# EAGLE design photoduino.shield.v.3.0 (EAGLE 6.1)
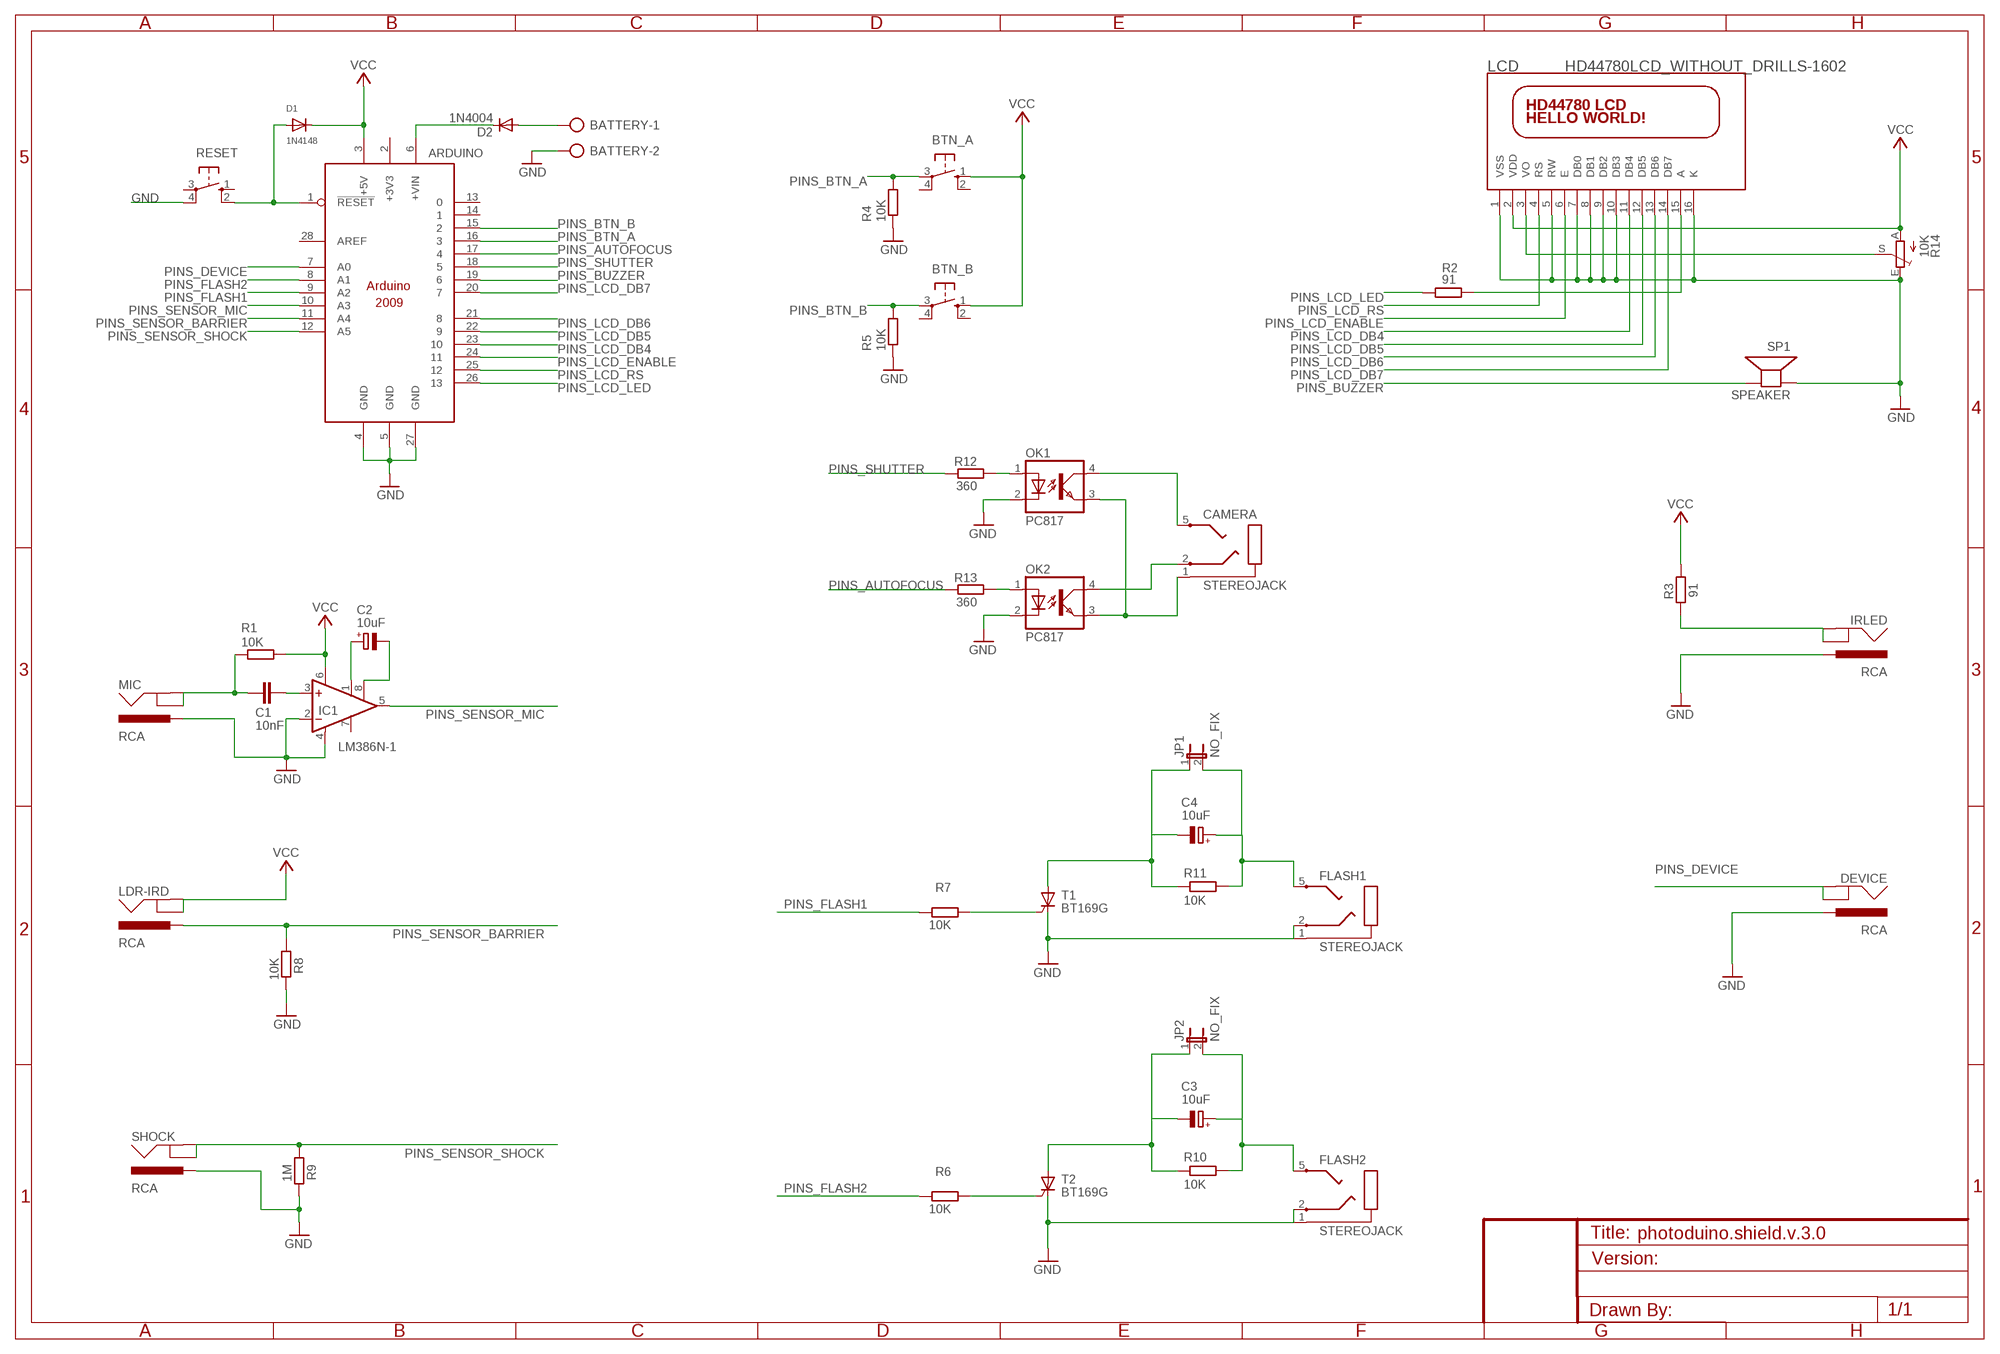
[diagram p0: schematic, sheet 1]

## Parts
ARDUINO  ARDUINO2009_12  [ARDUINO2009_2]
BATTERY  AK500/2  [AK500/2]
BTN_A  10-XX  [B3F-10XX]
BTN_B  10-XX  [B3F-10XX]
C1  10nF  C-EU050-025X075  [C050-025X075]
C2  10uF  CPOL-EUE2.5-7  [E2,5-7]
C3  10uF  CPOL-EUE2.5-7  [E2,5-7]
C4  10uF  CPOL-EUE2.5-7  [E2,5-7]
CAMERA  STEREOJACK  [STX3100-3N]
D1  1N4148  DIODEDO-1N4148  [DO-1N4148]
D2  1N4004  [DO41-10]
DEVICE  RCA  RCA_JACK_4UCON  [RCA_4UCON]
FLASH1  STEREOJACK  [STX3100-3N]
FLASH2  STEREOJACK  [STX3100-3N]
IC1  LM386N-1  [DIL08]
IRLED  RCA  RCA_JACK_4UCON  [RCA_4UCON]
JP1  NO_FIX  JP1E  [JP1]
JP2  NO_FIX  JP1E  [JP1]
LCD  HD44780LCD_WITHOUT_DRILLS-1602  [LCD1602]
LDR-IRD  RCA  RCA_JACK_4UCON  [RCA_4UCON]
MIC  RCA  RCA_JACK_4UCON  [RCA_4UCON]
OK1  PC817  [DIL04]
OK2  PC817  [DIL04]
R1  10K  R-EU_0207/7  [0207/7]
R2  91  R-EU_0207/7  [0207/7]
R3  91  R-EU_0207/7  [0207/7]
R4  10K  R-EU_0207/7  [0207/7]
R5  10K  R-EU_0207/7  [0207/7]
R6  10K  R-EU_0207/7  [0207/7]
R7  10K  R-EU_0207/7  [0207/7]
R8  10K  R-EU_0207/7  [0207/7]
R9  1M  R-EU_0207/7  [0207/7]
R10  10K  R-EU_0207/7  [0207/7]
R11  10K  R-EU_0207/7  [0207/7]
R12  360  R-EU_0207/7  [0207/7]
R13  360  R-EU_0207/7  [0207/7]
R14  10K  TRIM_EU-B25U  [B25U]
RESET  10-XX  [B3F-10XX]
SHOCK  RCA  RCA_JACK_4UCON  [RCA_4UCON]
SP1  SPEAKER  SPEAKER/PS12  [PS12]
T1  BT169G  BT169  [TO92-2]
T2  BT169G  BT169  [TO92-2]

## Nets
GND: ARDUINO.4(GND) ARDUINO.5(GND) ARDUINO.27(GND) BATTERY.2 DEVICE.BARREL FLASH1.1 FLASH1.2 FLASH2.1 FLASH2.2 IC1.2(-IN) IC1.4(GND) IRLED.BARREL LCD.1(VSS) LCD.5(RW) LCD.7(DB0) LCD.8(DB1) LCD.9(DB2) LCD.10(DB3) LCD.16(K) MIC.BARREL OK1.2(C) OK2.2(C) R4.1 R5.1 R8.2 R9.2 R14.E RESET.4(P1) SHOCK.BARREL SP1.P$1(+) T1.C T2.C
LCD_CONTRAST: LCD.3(VO) R14.S
N$1: IRLED.BREAK IRLED.SPRING R3.2
N$2: CAMERA.1 OK1.3(EMIT) OK2.3(EMIT)
N$3: C4.+ FLASH1.5 JP1.2 R11.2
N$4: R6.1 T2.G
N$5: ARDUINO.1(!RESET) D1.A RESET.2(S1)
N$6: C4.- JP1.1 R11.1 T1.A
N$8: C3.+ FLASH2.5 JP2.2 R10.2
N$9: C3.- JP2.1 R10.1 T2.A
N$11: ARDUINO.6(+VIN) D2.C
N$12: C1.1 IC1.3(+IN)
N$13: BATTERY.1 D2.A
N$16: C1.2 MIC.BREAK MIC.SPRING R1.1
N$18: R7.1 T1.G
N$21: CAMERA.5 OK1.4(COL)
N$23: OK1.1(A) R12.1
N$25: OK2.1(A) R13.1
N$27: C2.+ IC1.1(GAIN)
N$31: C2.- IC1.8(GAIN)
N$32: LCD.15(A) R2.1
PINS_AUTOFOCUS: ARDUINO.17 R13.2
PINS_BTN_A: ARDUINO.16 BTN_A.3(P) R4.2
PINS_BTN_B: ARDUINO.15 BTN_B.3(P) R5.2
PINS_BUZZER: ARDUINO.19 SP1.P$2(-)
PINS_DEVICE: ARDUINO.7(A0) DEVICE.BREAK DEVICE.SPRING
PINS_FLASH1: ARDUINO.9(A2) R7.2
PINS_FLASH2: ARDUINO.8(A1) R6.2
PINS_LCD_DB4: ARDUINO.23 LCD.11(DB4)
PINS_LCD_DB5: ARDUINO.22 LCD.12(DB5)
PINS_LCD_DB6: ARDUINO.21 LCD.13(DB6)
PINS_LCD_DB7: ARDUINO.20 LCD.14(DB7)
PINS_LCD_ENABLE: ARDUINO.24 LCD.6(E)
PINS_LCD_LED: ARDUINO.26 R2.2
PINS_LCD_RS: ARDUINO.25 LCD.4(RS)
PINS_SENSOR_BARRIER: ARDUINO.11(A4) LDR-IRD.BARREL R8.1
PINS_SENSOR_MIC: ARDUINO.10(A3) IC1.5(OUT)
PINS_SENSOR_SHOCK: ARDUINO.12(A5) R9.1 SHOCK.BREAK SHOCK.SPRING
PINS_SHUTTER: ARDUINO.18 R12.2
SHUTTER: CAMERA.2 OK2.4(COL)
VCC: ARDUINO.3(+5V) BTN_A.1(S) BTN_B.1(S) D1.C IC1.6(VS) LCD.2(VDD) LDR-IRD.BREAK LDR-IRD.SPRING R1.2 R3.1 R14.A
Unconnected: ARDUINO.13 ARDUINO.14 ARDUINO.28(AREF) BTN_A.2(S1) BTN_A.4(P1) BTN_B.2(S1) BTN_B.4(P1) IC1.7(BYPASS) RESET.1(S) RESET.3(P)

## Notes on the sheet
- DISPLAY LCD & BUZZER
- SENSORS
- SOUND SENSOR | BARRIER SENSOR | SHOCK SENSOR
- CONTROLLED DEVICES
- CAMERA CONTROL | FLASH1 CONTROL | FLASH2 CONTROL | DEVICE I/O PORT

## Power pins joined to a net without a drawn wire
+3V3: ARDUINO.2(+3V3)

## Library data of the parts
ARDUINO = componentes:ARDUINO2009_1: The Arduino Duemilanove ("2009") is a microcontroller board based on the ATmega168 or ATmega328. - 14 digital input/output pins (of which 6 can be used as PWM outputs) - 6 analog inputs, a 16 MHz crystal oscillator - USB connection - power jack - ISP header - reset button It contains everything needed to support the microcontroller; simply connect it to a computer with a USB cable or power it with a AC-to-DC adapter or battery to get started http://arduino.cc/en/Main/ArduinoBoardDuemilanove
BATTERY = con-ptr500:AK500/2: CONNECTOR; OC_FARNELL: unknown; OC_NEWARK: unknown
BTN_A BTN_B RESET = switch-omron:10-XX: OMRON SWITCH; MPN: B3F-1000; OC_FARNELL: 176432; OC_NEWARK: 36M3542
C1 = resistor:C-EU: CAPACITOR, European symbol
C2-C4 = resistor:CPOL-EU: POLARIZED CAPACITOR, European symbol
CAMERA FLASH1 FLASH2 = componentes:STEREOJACK: MIC/HEADPHONE JACK Stereo jack with two switches. Kycon STX3100-N
D1 = adafruit:DIODE: Diode SMADIODE - SMA Surface Mount Package 20V 1A Schottky Diode Digikey: 641-1014-6-ND DO-1N4148 - Through Hole Small Current Diode SOD-123 20V 1 A (.5mV Vf) Schottky Diode - Digikey: MBRX120TPMSCT-ND SOD-323 10V 570mA (.38mV Vf, 3ns) Schottky Diode - Digikey: ZLLS410CT-ND SOD-523 30V 30mA Schottky Diode (RB751S-40TE61) - Digikey: RB751S-40TE61CT-ND SOT23-R/W - SOT23 Package (R = Solder Paste/Reflow Ovens, W = Hand-Soldering) BAT54Film 40V 300mA - Digikey: 497-7162-1-ND
D2 = adafruit:1N4004: DIODE General purpose 1N400x type rectifier (With bigger pads) http://www.ladyada.net/library/pcb/eaglelibrary.html
DEVICE IRLED LDR-IRD MIC SHOCK = componentes:RCA_JACK_4UCON
IC1 = linear:LM386?-*: Low Voltage Audio Power Amplifier Source: http://cache.national.com/ds/LM/LM386.pdf
JP1 JP2 = jumper:JP1E: JUMPER
LCD = componentes:HD44780LCD_WITHOUT_DRILLS: HD44780 LCD Standard character type LCDs, available in sizes from 8x1 to 40x4!
OK1 OK2 = componentes:PC817: SHARP OPTO COUPLER; MPN: PC817X4J000F; OC_FARNELL: 9707727; OC_NEWARK: 97K7059
R1-R13 = resistor:R-EU_: RESISTOR, European symbol
R14 = componentes:TRIM_EU-: POTENTIOMETER
SP1 = adafruit:SPEAKER: SPEAKER Source: Buerklin Added PS12 (for part # PS1240 piezo) http://www.ladyada.net/library/pcb/eaglelibrary.html
T1 T2 = componentes:BT169: THYRISTOR

## Board
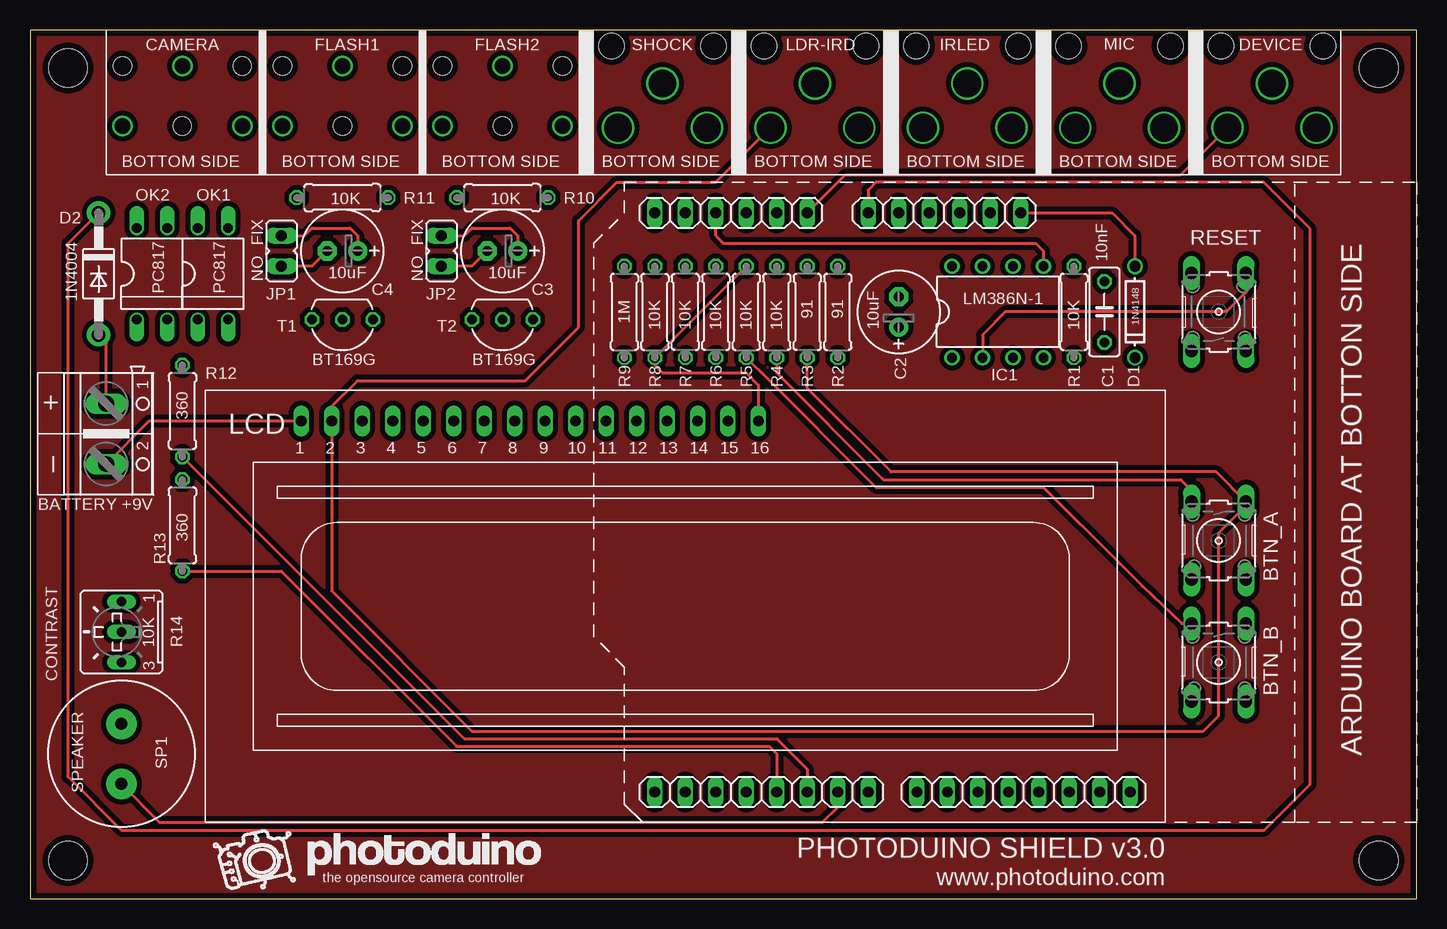
[diagram p1: board, top side]
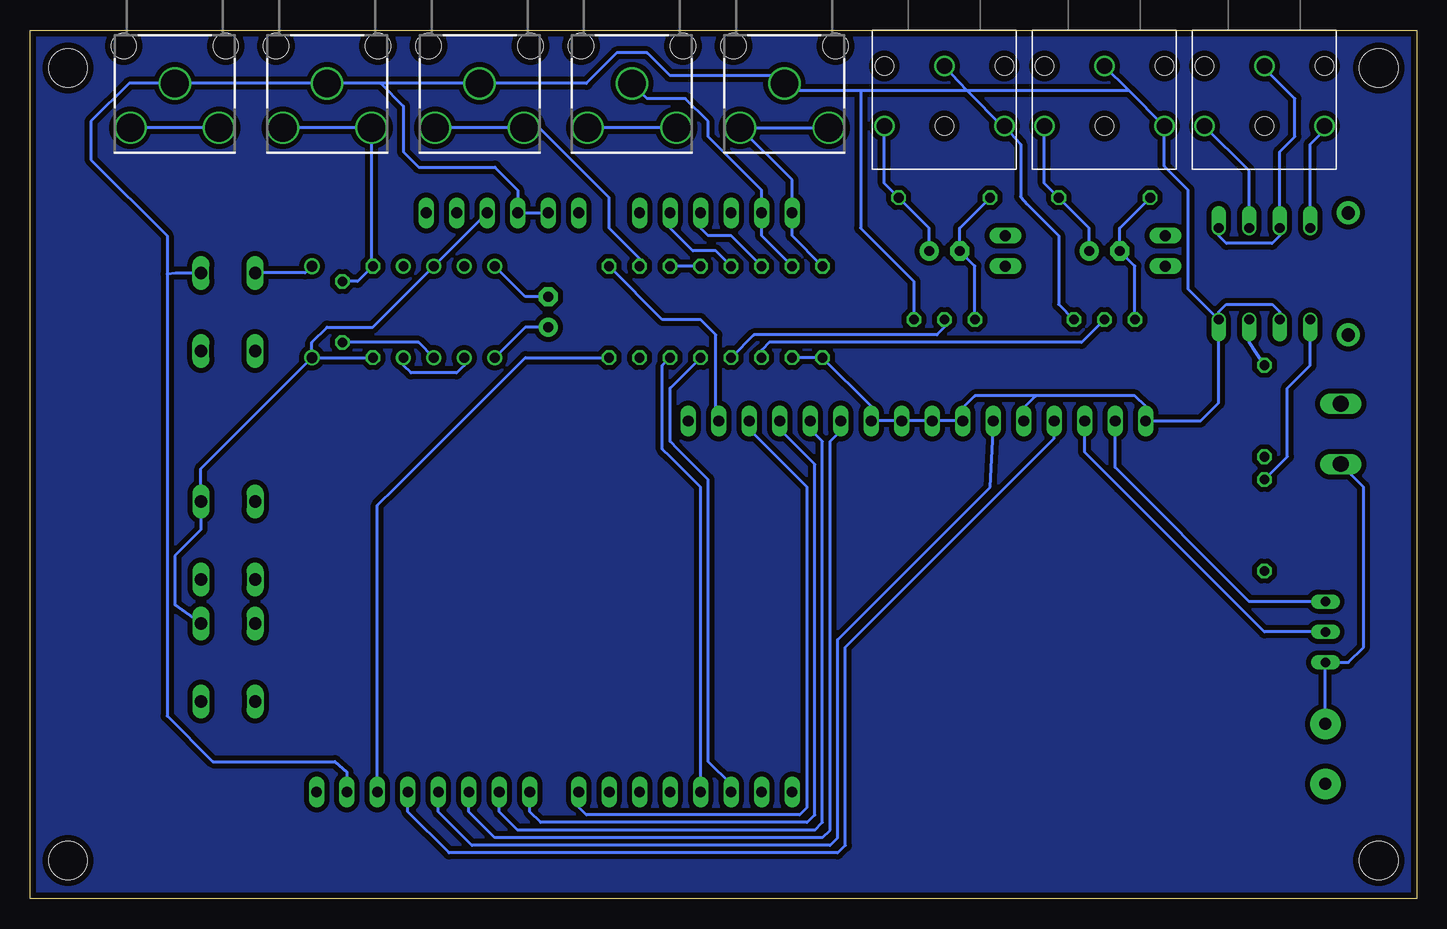
[diagram p2: board, bottom side, seen from below]

Size 115.57 x 72.39 mm. Coordinates in mm from the lower left corner, seen from the top.
Outline: 115.57,72.39 0,72.39 0,0 115.57,0 115.57,72.39
Copper layers (1*16): Top 0.035mm / dielectric 1.5mm / Bottom 0.035mm
Design rules: minimum track width 8mil, minimum drill 0.3mm, track to track 8mil, track to pad 8mil, pad to pad 8mil, via to via 8mil, smd to smd 8mil, copper to edge 20mil, drill to drill 8mil, minimum pad ring 8mil, minimum via ring 4mil, stop-mask expansion 3mil, vias tented up to drill 0mil, thermal gap 8mil
Holes 3.2 mm at 3.17,69.22 112.4,69.22 112.4,3.17 3.17,3.17

### Footprints (pad centres in the part's own frame; a part is rotated, then mirrored left to right if it is on the bottom)
ARDUINO2009_2 = drill 0.9 long: 1 33.02,2.54; 2 35.56,2.54; 3 38.1,2.54; 4 40.64,2.54; 5 43.18,2.54; 6 45.72,2.54; 7 50.8,2.54; 8 53.34,2.54; 9 55.88,2.54; 10 58.42,2.54; 11 60.96,2.54; 12 63.5,2.54; 13 63.5,50.8; 14 60.96,50.8; 15 58.42,50.8; 16 55.88,50.8; 17 53.34,50.8; 18 50.8,50.8; 19 48.26,50.8; 20 45.72,50.8; 21 41.656,50.8; 22 39.116,50.8; 23 36.576,50.8; 24 34.036,50.8; 25 31.496,50.8; 26 28.956,50.8; 27 26.416,50.8; 28 23.876,50.8
AK500/2 = drill 1.321 long: 1 -2.515,0; 2 2.515,0
B3F-10XX = drill 1.016 long: 1 -3.251,2.261; 2 3.251,2.261; 3 -3.251,-2.261; 4 3.251,-2.261
C050-025X075 = drill 0.813 octagon: 1 -2.54,0; 2 2.54,0
E2,5-7 = drill 0.813 pad 1.6: + -1.27,0 | drill 0.813 pad 1.6 octagon: - 1.27,0
STX3100-3N = drill 1.3: 1 3,0; 2 8,5; 5 8,-5 | hole 1.5: 3,5; 3,-5; 8,0
DO-1N4148 = drill 0.9: A -3.81,0; C 3.81,0
DO41-10 = drill 1.118 pad 1.93: A 5.08,0; C -5.08,0
RCA_4UCON = drill 2.3: BARREL 0,0; BREAK 3.7,3.7; SPRING 3.7,-3.7 | hole 2.1: -3.1,4.25; -3.1,-4.25
DIL08 = drill 0.813 pad 1.27: 1 -3.81,-3.81; 2 -1.27,-3.81; 3 1.27,-3.81; 4 3.81,-3.81; 5 3.81,3.81; 6 1.27,3.81; 7 -1.27,3.81; 8 -3.81,3.81
JP1 = drill 0.914 long: 1 0,-1.27; 2 0,1.27
LCD1602 = drill 0.9 long: 1 8,33.46; 2 10.54,33.46; 3 13.08,33.46; 4 15.62,33.46; 5 18.16,33.46; 6 20.7,33.46; 7 23.24,33.46; 8 25.78,33.46; 9 28.32,33.46; 10 30.86,33.46; 11 33.4,33.46; 12 35.94,33.46; 13 38.48,33.46; 14 41.02,33.46; 15 43.56,33.46; 16 46.1,33.46
DIL04 = drill 0.813 offset: 1 -1.27,-3.81; 2 1.27,-3.81; 3 1.27,3.81; 4 -1.27,3.81
0207/7 = drill 0.813 octagon: 1 -3.81,0; 2 3.81,0
B25U = drill 0.8 long: A 2.54,0; E -2.54,0; S 0,0
PS12 = drill 1 pad 2.54: P$1 -2.5,0; P$2 2.5,0
TO92-2 = drill 0.813 octagon: A 2.54,0; C -2.54,0; G 0,0

### Placement (x,y rotation side)
ARDUINO  115.57,59.69 180 top
BATTERY  6.35,38.73 270 top
BTN_A  99.06,29.84 270 top
BTN_B  99.06,19.69 270 top
C1  89.53,48.9 90 top
C2  72.39,48.9 90 top
C3  39.37,53.98 180 top
C4  26.04,53.98 180 top
CAMERA  12.7,72.39 270 bottom
D1  92.08,48.9 270 top
D2  5.71,52.07 270 top
DEVICE  103.51,67.94 270 bottom
FLASH1  26.04,72.39 270 bottom
FLASH2  39.37,72.39 270 bottom
IC1  80.65,48.9 0 top
IRLED  78.11,67.94 270 bottom
JP1  20.95,53.98 0 top
JP2  34.29,53.98 0 top
LCD  14.61,6.35 0 top
LDR-IRD  65.41,67.94 270 bottom
MIC  90.81,67.94 270 bottom
OK1  15.24,52.07 0 top
OK2  10.16,52.07 0 top
R1  87,48.9 270 top
R2  67.31,48.9 270 top
R3  64.77,48.9 90 top
R4  62.23,48.9 270 top
R5  59.69,48.9 270 top
R6  57.15,48.9 90 top
R7  54.61,48.9 90 top
R8  52.07,48.9 270 top
R9  49.53,48.9 270 top
R10  39.37,58.42 0 top
R11  26.04,58.42 0 top
R12  12.7,40.64 270 top
R13  12.7,31.12 270 top
R14  7.62,22.23 90 top
RESET  99.06,48.9 90 top
SHOCK  52.7,67.94 270 bottom
SP1  7.62,12.06 270 top
T1  26.04,48.26 180 top
T2  39.37,48.26 180 top
U$2  [LOGOPHOTODUINO2]  15.24,0.63 0 top

### Tracks (layer width: path | path; a pad name or v marks a point on that pad's centre or on a via)
GND
  Top 0.254: R5.1 R8.2 52.07,44.45 52.7,43.82 59.69,43.82 60.7,42.8 LCD.16 | RESET.4 101.32,50.52 99.7,48.9 81.28,48.9 79.38,46.99 IC1.2 | LCD.1 9.94,39.81 BATTERY.2
  Bottom 0.254: OK2.2 11.43,48.9 12.06,49.53 15.88,49.53 16.51,48.9 OK1.2 | R5.1 R4.1 | IC1.2 79.38,44.45 80.01,43.82 83.82,43.82 84.45,44.45 IC1.4 | R8.2 R9.2 45.47,41.02 LCD.10 LCD.9 LCD.8 LCD.7 37.84,40.9 36.83,41.91 31.75,41.91 | ARDUINO.5 ARDUINO.4 74.93,59.05 76.84,60.96 83.19,60.96 84.45,62.23 84.45,66.04 86.36,67.94 | OK1.2 16.51,41.33 18.03,39.81 LCD.1 22.61,41.02 23.5,41.91 31.75,41.91 | 37.47,67.31 46.36,67.31 | 46.36,67.31 52.07,67.31 SHOCK.BARREL 53.34,68.58 62.23,68.58 64.14,70.48 66.67,70.48 69.22,67.94 IRLED.BARREL 86.36,67.94 | 37.47,67.31 FLASH2.1 | T1.C 29.84,49.53 29.84,55.25 32.47,57.87 33.02,58.5 33.02,62.87 FLASH2.2 34.55,64.39 37.47,67.31 | T2.C 41.91,51.44 46.36,55.88 46.36,67.31 | 86.36,67.94 MIC.BARREL DEVICE.BARREL 107.31,67.94 110.49,64.77 110.49,61.59 104.14,55.25 104.14,52.07 | LCD.5 32.77,40.9 31.75,41.91 | 23.95,67.31 FLASH1.1 | OK1.2 19.05,50.8 19.05,59.05 21.04,61.04 FLASH1.2 23.95,67.31 | SP1.P$1 R14.E 5.71,19.69 4.45,20.95 4.45,34.29 6.35,36.2 BATTERY.2 | 104.14,52.07 104.14,15.24 100.33,11.43 90.17,11.43 89.15,10.54 ARDUINO.27 | RESET.4 103.43,52.15 104.14,52.07 | 23.95,67.31 37.47,67.31
LCD_CONTRAST
  Bottom 0.254: R14.S 12.7,22.23 24.77,34.29 27.68,37.21 LCD.3
N$1
  Bottom 0.254: IRLED.SPRING IRLED.BREAK 74.3,64.13 73.03,64.13 67.31,58.42 67.31,55.88 64.77,53.34 R3.2
N$2
  Bottom 0.254: OK1.3 16.51,55.25 15.88,54.61 12.06,54.61 11.43,55.25 OK2.3 11.43,62.23 10.16,63.5 10.16,66.67 12.7,69.22 CAMERA.1
N$3
  Top 0.254: JP1.2 22.86,55.25 23.5,55.88 26.67,55.88 27.3,55.25 C4.+
  Bottom 0.254: C4.+ 27.3,55.88 R11.2 31.04,59.61 FLASH1.5
N$4
  Bottom 0.254: T2.G 39.37,47.62 40,46.99 55.25,46.99 R6.1
N$5
  Top 0.254: D1.A 92.08,55.25 90.17,57.15 87.63,57.15 ARDUINO.1
  Bottom 0.254: RESET.2 92.63,52.15 D1.A
N$6
  Top 0.254: JP1.1 23.5,52.7 C4.-
  Bottom 0.254: R11.1 24.77,55.88 C4.- 23.5,52.7 T1.A
N$7
  pour Top (isolate 0.406, rank 3): 0,72.39 115.57,72.39 115.57,0 0,0
N$8
  Top 0.254: JP2.2 36.2,55.25 36.83,55.88 40,55.88 40.64,55.25 C3.+
  Bottom 0.254: C3.+ 40.64,55.88 R10.2 44.37,59.61 FLASH2.5
N$9
  Top 0.254: JP2.1 36.83,52.7 C3.-
  Bottom 0.254: R10.1 38.1,55.88 C3.- 36.83,52.7 T2.A
N$10
  pour Bottom (isolate 0.406): 0,72.39 115.57,72.39 115.57,0 0,0
N$11
  Top 0.254: D2.C 3.17,54.61 3.17,10.16 7.62,5.71 102.87,5.71 106.68,9.52 106.68,55.83 102.82,59.69 70.48,59.69 69.85,59.05 ARDUINO.6
N$12
  Bottom 0.254: C1.1 83.19,46.36 IC1.3
N$13
  Top 0.254: D2.A 6.35,46.36 BATTERY.1
N$16
  Bottom 0.254: MIC.SPRING MIC.BREAK 87.11,52.82 R1.1 88.27,51.44 C1.2
N$18
  Bottom 0.254: R7.1 54.61,45.72 53.97,46.36 27.94,46.36 T1.G
N$21
  Bottom 0.254: OK1.4 13.97,60.66 CAMERA.5
N$23
  Bottom 0.254: R12.1 13.97,46.36 OK1.1
N$25
  Bottom 0.254: OK2.1 8.89,44.45 10.79,42.55 10.79,36.83 R13.1
N$27
  Bottom 0.254: C2.+ 74.3,47.62 IC1.1
N$31
  Bottom 0.254: C2.- 74.3,50.16 IC1.8
N$32
  Bottom 0.254: R2.1 62.86,48.26 59.69,48.26 58.42,46.99 58.42,40.07 LCD.15
PINS_AUTOFOCUS
  Top 0.254: ARDUINO.17 62.23,12.06 61.59,12.7 35.56,12.7 20.95,27.3 R13.2
PINS_BTN_A
  Top 0.254: R4.2 62.23,43.82 71.04,35.01 71.12,34.92 94.62,34.92 95.89,34.92 96.8,34.01 BTN_A.3
  Bottom 0.254: R4.2 62.86,44.45 62.86,37.46 62.23,36.83 59.69,34.29 59.69,18.41 59.69,9.52 ARDUINO.16
PINS_BTN_B
  Top 0.254: R5.2 60.33,44.45 60.88,43.89 70.48,34.29 84.45,34.29 90.81,27.94 92.71,26.03 95.96,22.94 BTN_B.3
  Bottom 0.254: R5.2 62.23,42.55 62.23,38.1 61.59,37.46 60.33,36.2 59.06,34.92 59.06,33.66 59.06,14.61 59.06,11.43 57.15,9.52 ARDUINO.15
PINS_BUZZER
  Top 0.254: SP1.P$2 10.75,6.39 10.79,6.35 13.97,6.35 66.04,6.35 67.31,7.62 ARDUINO.19
PINS_DEVICE
  Top 0.254: ARDUINO.7 67.94,60.33 95.89,60.33 DEVICE.BREAK
  Bottom 0.254: DEVICE.BREAK DEVICE.SPRING
PINS_FLASH1
  Bottom 0.254: R7.2 57.15,55.25 59.06,55.25 59.69,55.88 ARDUINO.9
PINS_FLASH2
  Bottom 0.254: R6.2 58.42,53.98 60.33,53.98 62.23,55.88 ARDUINO.8
PINS_LCD_DB4
  Bottom 0.254: LCD.11 48,38.99 48.89,38.1 48.89,5.71 49.53,5.08 76.84,5.08 78.99,7.24 ARDUINO.23
PINS_LCD_DB5
  Bottom 0.254: LCD.12 50.55,39.12 49.53,38.1 49.53,6.35 50.17,5.71 74.93,5.71 76.45,7.24 ARDUINO.22
PINS_LCD_DB6
  Bottom 0.254: LCD.13 53.08,39.12 50.17,36.2 50.17,6.98 50.8,6.35 73.03,6.35 73.91,7.24 ARDUINO.21
PINS_LCD_DB7
  Bottom 0.254: LCD.14 55.62,39.12 50.8,34.29 50.8,7.62 51.44,6.98 69.22,6.98 69.85,7.62 ARDUINO.20
PINS_LCD_ENABLE
  Bottom 0.254: LCD.6 35.3,38.99 35.56,34.29 48.26,21.59 48.26,5.08 48.89,4.44 78.74,4.44 81.53,7.24 ARDUINO.24
PINS_LCD_LED
  Bottom 0.254: R2.2 74.3,45.09 85.09,34.29 86.61,32.77 ARDUINO.26
PINS_LCD_RS
  Bottom 0.254: LCD.4 30.23,38.36 47.62,20.95 47.62,4.44 48.26,3.81 80.65,3.81 84.07,7.24 ARDUINO.25
PINS_SENSOR_BARRIER
  Bottom 0.254: R8.1 54.61,55.25 ARDUINO.11 54.61,59.05 59.06,63.5 59.06,64.77 60.96,66.67 64.14,66.67 LDR-IRD.BARREL
PINS_SENSOR_MIC
  Top 0.254: IC1.5 84.45,53.98 83.82,54.61 82.55,54.61 57.78,54.61 57.15,55.25 ARDUINO.10
PINS_SENSOR_SHOCK
  Bottom 0.254: R9.1 52.07,55.25 ARDUINO.12 52.07,59.91 SHOCK.SPRING SHOCK.BREAK
PINS_SHUTTER
  Top 0.254: ARDUINO.18 64.77,10.79 62.23,13.34 36.2,13.34 R12.2
SHUTTER
  Bottom 0.254: CAMERA.2 7.7,64.05 8.89,62.87 OK2.4
VCC
  Top 0.254: R3.1 64.77,42.55 71.76,35.56 98.86,35.56 BTN_A.1 101.32,32.74 99.06,30.48 99.06,15.24 97.79,13.97 36.83,13.97 25.14,25.66 LCD.2 25.14,41.02 27.3,43.18 41.28,43.18 45.72,47.62 45.72,56.52 48.89,59.69 57.15,59.69 LDR-IRD.BREAK
  Bottom 0.254: D1.C R1.2 | D1.C 101.32,35.84 BTN_A.1 101.32,30.76 103.51,28.58 103.51,24.49 BTN_B.1 | ARDUINO.3 IC1.6 87,47.62 90.81,47.62 92.08,46.36 D1.C | LDR-IRD.SPRING LDR-IRD.BREAK 61.59,64.13 | R14.A 13.97,24.77 25.14,35.94 LCD.2

### Text on the board
tPlace: BOTTOM SIDE | BOTTOM SIDE | BOTTOM SIDE | BOTTOM SIDE | BOTTOM SIDE | BOTTOM SIDE | BOTTOM SIDE | BOTTOM SIDE | + | _ | +9V | CONTRAST
tNames: BATTERY | PHOTODUINO SHIELD v3.0 | www.photoduino.com